# EAGLE schematic rpi-stack-lights (EAGLE 9.5.2)
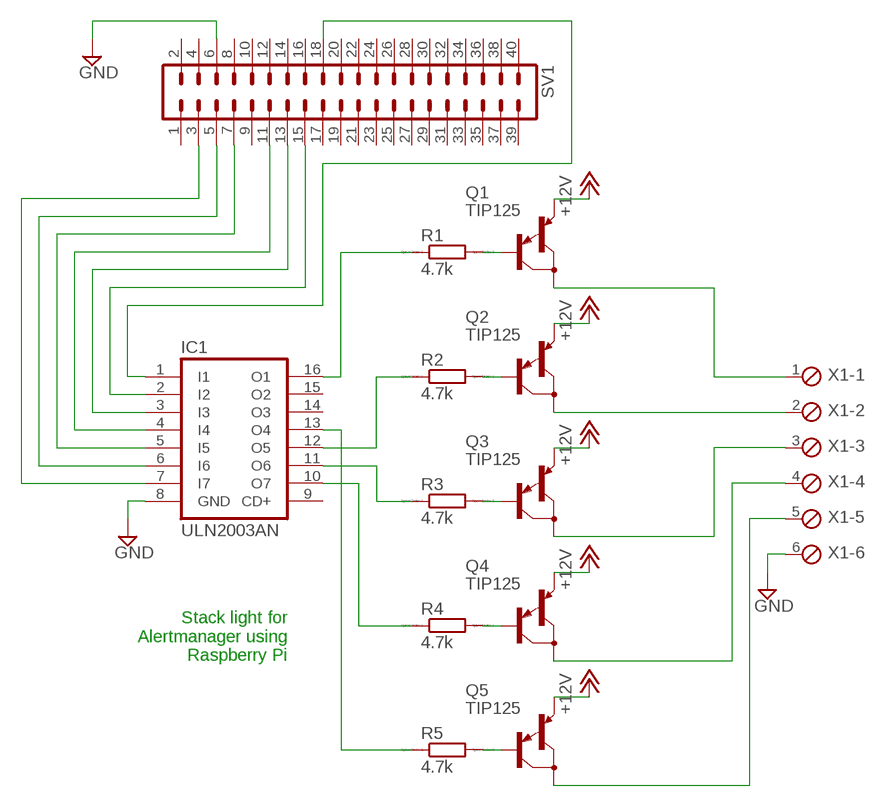
[diagram p0: schematic, sheet 1]

## Parts
IC1  ULN2003AN  [DIL16]
Q1  TIP125  [TO220]
Q2  TIP125  [TO220]
Q3  TIP125  [TO220]
Q4  TIP125  [TO220]
Q5  TIP125  [TO220]
R1  4.7k  R0204/7  [0204/7]
R2  4.7k  R0204/7  [0204/7]
R3  4.7k  R0204/7  [0204/7]
R4  4.7k  R0204/7  [0204/7]
R5  4.7k  R0204/7  [0204/7]
SV1  MA20-2  [MA20-2]
X1  MPT6  [6POL254]

## Nets
+12V: Q1.3(E) Q2.3(E) Q3.3(E) Q4.3(E) Q5.3(E)
GND: IC1.8(GND) SV1.6 X1.6
N$1: Q1.1(B) R1.2
N$2: Q2.1(B) R2.2
N$3: Q3.1(B) R3.2
N$4: Q4.1(B) R4.2
N$5: Q5.1(B) R5.2
N$6: IC1.16(O1) R1.1
N$7: IC1.12(O5) R2.1
N$8: IC1.11(O6) R3.1
N$9: IC1.10(O7) R4.1
N$10: IC1.13(O4) R5.1
N$11: IC1.7(I7) SV1.3
N$12: IC1.6(I6) SV1.5
N$13: IC1.5(I5) SV1.7
N$14: IC1.1(I1) SV1.18
N$15: IC1.4(I4) SV1.11
N$16: IC1.3(I3) SV1.13
N$17: IC1.2(I2) SV1.15
N$18: Q1.2(C) X1.1
N$19: Q4.2(C) X1.4
N$21: Q5.2(C) X1.5
N$22: Q3.2(C) X1.3
N$23: Q2.2(C) X1.2
Unconnected: IC1.9(CD+) IC1.14(O3) IC1.15(O2) SV1.1 SV1.2 SV1.4 SV1.8 SV1.9 SV1.10 SV1.12 SV1.14 SV1.16 SV1.17 SV1.19 SV1.20 SV1.21 SV1.22 SV1.23 SV1.24 SV1.25 SV1.26 SV1.27 SV1.28 SV1.29 SV1.30 SV1.31 SV1.32 SV1.33 SV1.34 SV1.35 SV1.36 SV1.37 SV1.38 SV1.39 SV1.40

## Notes on the sheet
- Stack light for
  Alertmanager using
  Raspberry Pi

## Library data of the parts
IC1 = uln-udn:ULN2003A: DRIVER ARRAY
Q1-Q5 = transistor-pnp:TIP125: PNP Transistor
R1-R5 = eagle-ltspice:R: RESISTOR, European symbol; SPICEMODEL: NONE; SPICEPREFIX: R
SV1 = con-lstb:MA20-2: PIN HEADER; OC_FARNELL: unknown; OC_NEWARK: unknown
X1 = con-phoenix-254:MPT6: PHOENIX CONNECTOR; OC_FARNELL: unknown; OC_NEWARK: unknown